# Altium schematic sheet Sheet_1_2024-08-14.schdoc
size 178 x 77 mm
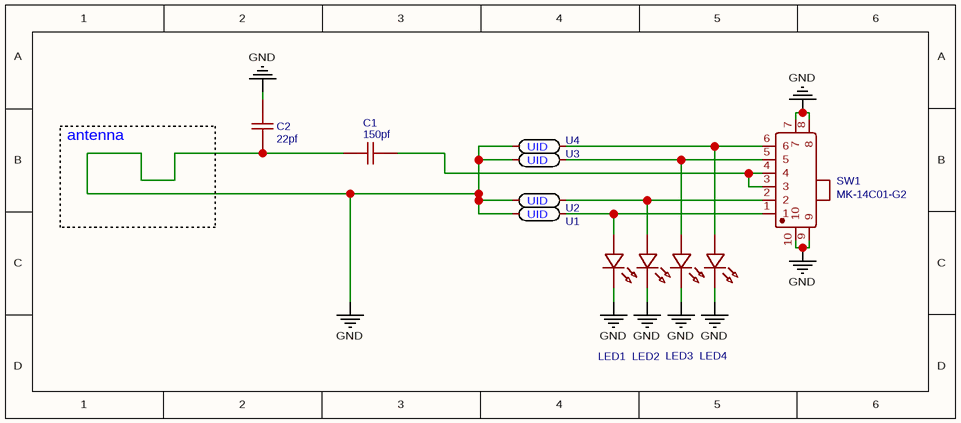
[diagram p0: Sheet_1_2024-08-14.schdoc]

## Parts
C1  150pf  [C0402]
C2  22pf  [C0402]
LED1  LED-0603_G  [LED0603_GREEN]  (value not drawn)
LED2  LED-0603_G  [LED0603_GREEN]  (value not drawn)
LED3  LED-0603_G  [LED0603_GREEN]  (value not drawn)
LED4  LED-0603_G  [LED0603_GREEN]  (value not drawn)
SW1  MK-14C01-G2  [SW-SMD_DEALON_MK-14C01-G2]
U1  NFC-CUID-COB  [NFC_CUID_COB]  (value not drawn)
U2  NFC-CUID-COB  [NFC_CUID_COB]  (value not drawn)
U3  NFC-CUID-COB  [NFC_CUID_COB]  (value not drawn)
U4  NFC-CUID-COB  [NFC_CUID_COB]  (value not drawn)

## Nets
GND: C1.1 C2.1 C2.2 LED1.2 LED2.2 LED3.2 LED4.2 SW1.7 SW1.8 SW1.9 SW1.10 U1.2 U2.2 U3.2 U4.2
NetC1_2: C1.2 SW1.3 SW1.4
NetLED1_1: LED1.1 SW1.1 U1.1
NetLED2_1: LED2.1 SW1.2 U2.1
NetLED3_1: LED3.1 SW1.5 U3.1
NetLED4_1: LED4.1 SW1.6 U4.1

## Notes on the sheet
- antenna
- (in symbol NFC-CUID-COB) UID

## Library data of the parts
C1 = 150pf: Manufacturer: TORCH(火炬); Manufacturer Part: C0402B103K500NT; Contributor: lcsc; Supplier: LCSC; Supplier Part: C17702727; spicePre: U; spiceSymbolName: C0402B103K500NT
C2 = 22pf: Manufacturer: TORCH(火炬); Manufacturer Part: C0402B103K500NT; Contributor: lcsc; Supplier: LCSC; Supplier Part: C17702727; spicePre: U; spiceSymbolName: C0402B103K500NT
LED1-LED4 = LED-0603_G: Manufacturer: EVERLIGHT(台湾亿光); Manufacturer Part: 19-217/GHC-YR1S2/3T; Contributor: LCEDA_Lib; Supplier Part: C72043; Supplier: LCSC; spicePre: L; spiceSymbolName: LED-0603_G
SW1 = MK-14C01-G2: Manufacturer: DEALON(德艺隆); Contributor: LCSC; Supplier: LCSC; Supplier Part: C2904918; Manufacturer Part: MK-14C01-G2; JLCPCB Part Class: Extended Part; spicePre: S; spiceSymbolName: MK-14C01-G2
U1-U4 = NFC-CUID-COB: Contributor: OTTER; spicePre: U; spiceSymbolName: NFC-CUID-COB